# Altium schematic sheet 15-DPLL_2.SchDoc
size C; SheetNumber: 14; SheetTotal: 16
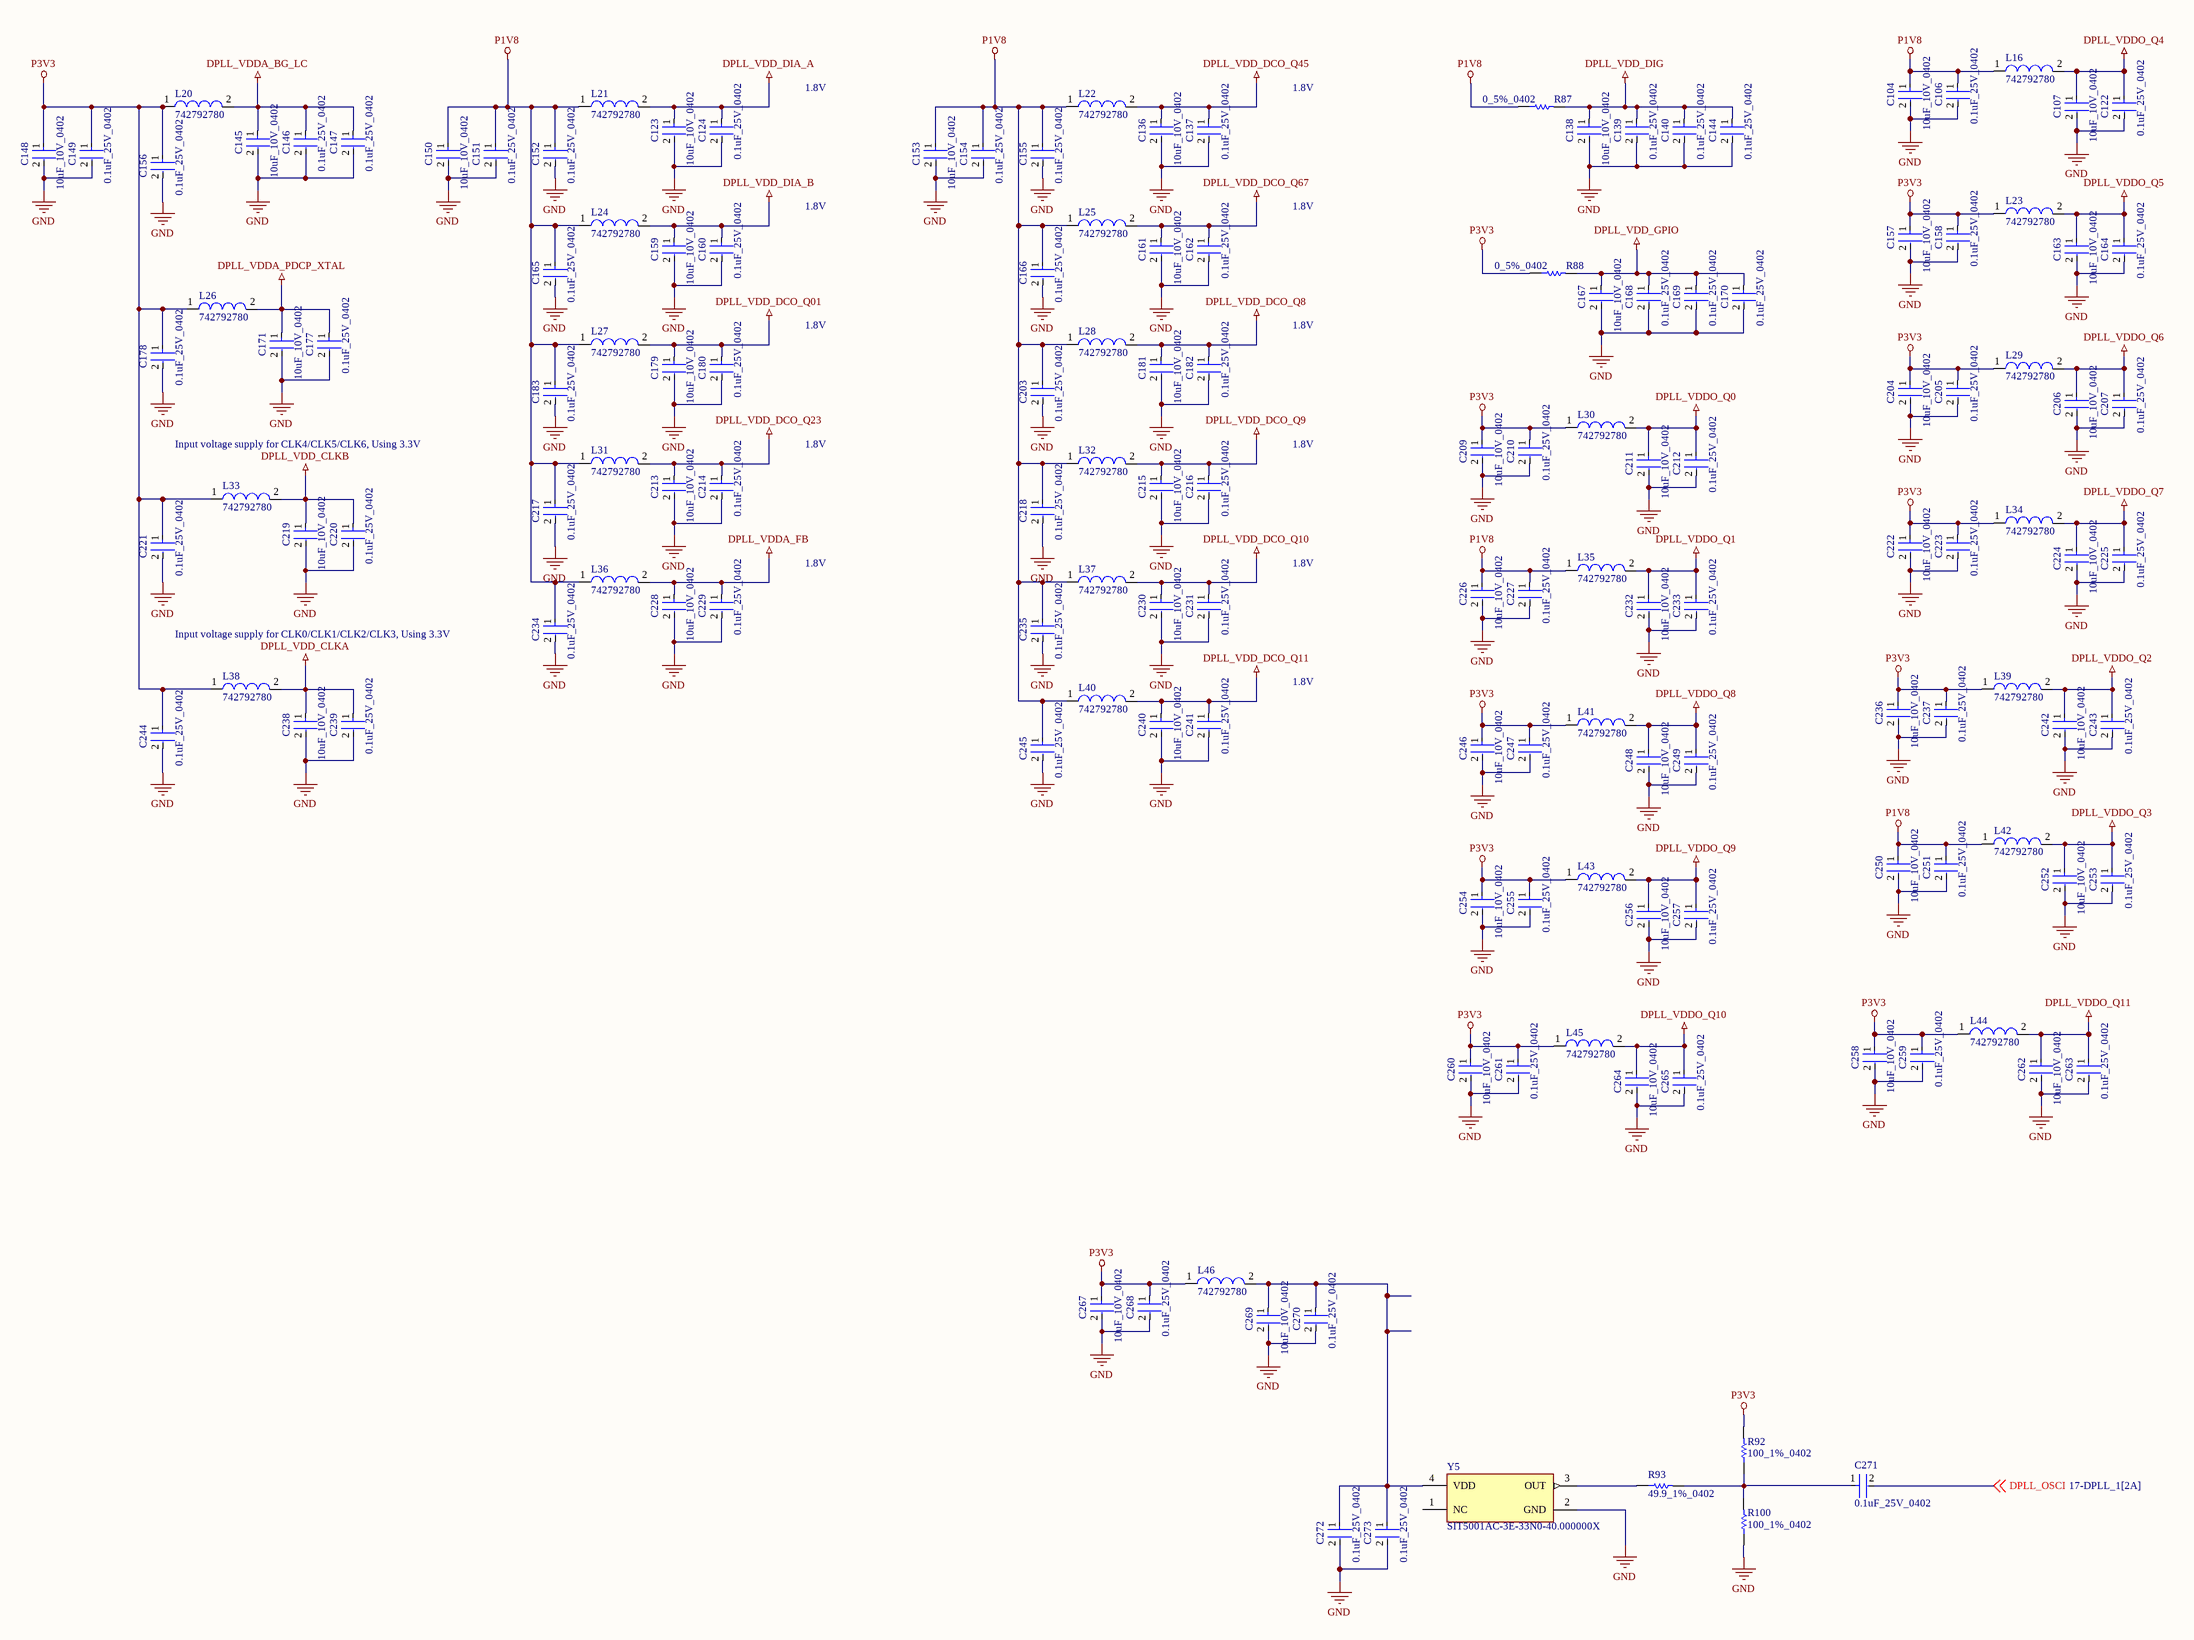
[diagram p0: 15-DPLL_2.SchDoc]

## Parts
C104  10uF_10V_0402  [FP-CL05A106MP5NUNC-MFG]
C106  0.1uF_25V_0402  [FP-0402-L_1_0_1-W_0_5_0_1-IPC_C]
C107  10uF_10V_0402  [FP-CL05A106MP5NUNC-MFG]
C122  0.1uF_25V_0402  [FP-0402-L_1_0_1-W_0_5_0_1-IPC_C]
C123  10uF_10V_0402  [FP-CL05A106MP5NUNC-MFG]
C124  0.1uF_25V_0402  [FP-0402-L_1_0_1-W_0_5_0_1-IPC_C]
C136  10uF_10V_0402  [FP-CL05A106MP5NUNC-MFG]
C137  0.1uF_25V_0402  [FP-0402-L_1_0_1-W_0_5_0_1-IPC_C]
C138  10uF_10V_0402  [FP-CL05A106MP5NUNC-MFG]
C139  0.1uF_25V_0402  [FP-0402-L_1_0_1-W_0_5_0_1-IPC_C]
C140  0.1uF_25V_0402  [FP-0402-L_1_0_1-W_0_5_0_1-IPC_C]
C144  0.1uF_25V_0402  [FP-0402-L_1_0_1-W_0_5_0_1-IPC_C]
C145  10uF_10V_0402  [FP-CL05A106MP5NUNC-MFG]
C146  0.1uF_25V_0402  [FP-0402-L_1_0_1-W_0_5_0_1-IPC_C]
C147  0.1uF_25V_0402  [FP-0402-L_1_0_1-W_0_5_0_1-IPC_C]
C148  10uF_10V_0402  [FP-CL05A106MP5NUNC-MFG]
C149  0.1uF_25V_0402  [FP-0402-L_1_0_1-W_0_5_0_1-IPC_C]
C150  10uF_10V_0402  [FP-CL05A106MP5NUNC-MFG]
C151  0.1uF_25V_0402  [FP-0402-L_1_0_1-W_0_5_0_1-IPC_C]
C152  0.1uF_25V_0402  [FP-0402-L_1_0_1-W_0_5_0_1-IPC_C]
C153  10uF_10V_0402  [FP-CL05A106MP5NUNC-MFG]
C154  0.1uF_25V_0402  [FP-0402-L_1_0_1-W_0_5_0_1-IPC_C]
C155  0.1uF_25V_0402  [FP-0402-L_1_0_1-W_0_5_0_1-IPC_C]
C156  0.1uF_25V_0402  [FP-0402-L_1_0_1-W_0_5_0_1-IPC_C]
C157  10uF_10V_0402  [FP-CL05A106MP5NUNC-MFG]
C158  0.1uF_25V_0402  [FP-0402-L_1_0_1-W_0_5_0_1-IPC_C]
C159  10uF_10V_0402  [FP-CL05A106MP5NUNC-MFG]
C160  0.1uF_25V_0402  [FP-0402-L_1_0_1-W_0_5_0_1-IPC_C]
C161  10uF_10V_0402  [FP-CL05A106MP5NUNC-MFG]
C162  0.1uF_25V_0402  [FP-0402-L_1_0_1-W_0_5_0_1-IPC_C]
C163  10uF_10V_0402  [FP-CL05A106MP5NUNC-MFG]
C164  0.1uF_25V_0402  [FP-0402-L_1_0_1-W_0_5_0_1-IPC_C]
C165  0.1uF_25V_0402  [FP-0402-L_1_0_1-W_0_5_0_1-IPC_C]
C166  0.1uF_25V_0402  [FP-0402-L_1_0_1-W_0_5_0_1-IPC_C]
C167  10uF_10V_0402  [FP-CL05A106MP5NUNC-MFG]
C168  0.1uF_25V_0402  [FP-0402-L_1_0_1-W_0_5_0_1-IPC_C]
C169  0.1uF_25V_0402  [FP-0402-L_1_0_1-W_0_5_0_1-IPC_C]
C170  0.1uF_25V_0402  [FP-0402-L_1_0_1-W_0_5_0_1-IPC_C]
C171  10uF_10V_0402  [FP-CL05A106MP5NUNC-MFG]
C177  0.1uF_25V_0402  [FP-0402-L_1_0_1-W_0_5_0_1-IPC_C]
C178  0.1uF_25V_0402  [FP-0402-L_1_0_1-W_0_5_0_1-IPC_C]
C179  10uF_10V_0402  [FP-CL05A106MP5NUNC-MFG]
C180  0.1uF_25V_0402  [FP-0402-L_1_0_1-W_0_5_0_1-IPC_C]
C181  10uF_10V_0402  [FP-CL05A106MP5NUNC-MFG]
C182  0.1uF_25V_0402  [FP-0402-L_1_0_1-W_0_5_0_1-IPC_C]
C183  0.1uF_25V_0402  [FP-0402-L_1_0_1-W_0_5_0_1-IPC_C]
C203  0.1uF_25V_0402  [FP-0402-L_1_0_1-W_0_5_0_1-IPC_C]
C204  10uF_10V_0402  [FP-CL05A106MP5NUNC-MFG]
C205  0.1uF_25V_0402  [FP-0402-L_1_0_1-W_0_5_0_1-IPC_C]
C206  10uF_10V_0402  [FP-CL05A106MP5NUNC-MFG]
C207  0.1uF_25V_0402  [FP-0402-L_1_0_1-W_0_5_0_1-IPC_C]
C209  10uF_10V_0402  [FP-CL05A106MP5NUNC-MFG]
C210  0.1uF_25V_0402  [FP-0402-L_1_0_1-W_0_5_0_1-IPC_C]
C211  10uF_10V_0402  [FP-CL05A106MP5NUNC-MFG]
C212  0.1uF_25V_0402  [FP-0402-L_1_0_1-W_0_5_0_1-IPC_C]
C213  10uF_10V_0402  [FP-CL05A106MP5NUNC-MFG]
C214  0.1uF_25V_0402  [FP-0402-L_1_0_1-W_0_5_0_1-IPC_C]
C215  10uF_10V_0402  [FP-CL05A106MP5NUNC-MFG]
C216  0.1uF_25V_0402  [FP-0402-L_1_0_1-W_0_5_0_1-IPC_C]
C217  0.1uF_25V_0402  [FP-0402-L_1_0_1-W_0_5_0_1-IPC_C]
C218  0.1uF_25V_0402  [FP-0402-L_1_0_1-W_0_5_0_1-IPC_C]
C219  10uF_10V_0402  [FP-CL05A106MP5NUNC-MFG]
C220  0.1uF_25V_0402  [FP-0402-L_1_0_1-W_0_5_0_1-IPC_C]
C221  0.1uF_25V_0402  [FP-0402-L_1_0_1-W_0_5_0_1-IPC_C]
C222  10uF_10V_0402  [FP-CL05A106MP5NUNC-MFG]
C223  0.1uF_25V_0402  [FP-0402-L_1_0_1-W_0_5_0_1-IPC_C]
C224  10uF_10V_0402  [FP-CL05A106MP5NUNC-MFG]
C225  0.1uF_25V_0402  [FP-0402-L_1_0_1-W_0_5_0_1-IPC_C]
C226  10uF_10V_0402  [FP-CL05A106MP5NUNC-MFG]
C227  0.1uF_25V_0402  [FP-0402-L_1_0_1-W_0_5_0_1-IPC_C]
C228  10uF_10V_0402  [FP-CL05A106MP5NUNC-MFG]
C229  0.1uF_25V_0402  [FP-0402-L_1_0_1-W_0_5_0_1-IPC_C]
C230  10uF_10V_0402  [FP-CL05A106MP5NUNC-MFG]
C231  0.1uF_25V_0402  [FP-0402-L_1_0_1-W_0_5_0_1-IPC_C]
C232  10uF_10V_0402  [FP-CL05A106MP5NUNC-MFG]
C233  0.1uF_25V_0402  [FP-0402-L_1_0_1-W_0_5_0_1-IPC_C]
C234  0.1uF_25V_0402  [FP-0402-L_1_0_1-W_0_5_0_1-IPC_C]
C235  0.1uF_25V_0402  [FP-0402-L_1_0_1-W_0_5_0_1-IPC_C]
C236  10uF_10V_0402  [FP-CL05A106MP5NUNC-MFG]
C237  0.1uF_25V_0402  [FP-0402-L_1_0_1-W_0_5_0_1-IPC_C]
C238  10uF_10V_0402  [FP-CL05A106MP5NUNC-MFG]
C239  0.1uF_25V_0402  [FP-0402-L_1_0_1-W_0_5_0_1-IPC_C]
C240  10uF_10V_0402  [FP-CL05A106MP5NUNC-MFG]
C241  0.1uF_25V_0402  [FP-0402-L_1_0_1-W_0_5_0_1-IPC_C]
C242  10uF_10V_0402  [FP-CL05A106MP5NUNC-MFG]
C243  0.1uF_25V_0402  [FP-0402-L_1_0_1-W_0_5_0_1-IPC_C]
C244  0.1uF_25V_0402  [FP-0402-L_1_0_1-W_0_5_0_1-IPC_C]
C245  0.1uF_25V_0402  [FP-0402-L_1_0_1-W_0_5_0_1-IPC_C]
C246  10uF_10V_0402  [FP-CL05A106MP5NUNC-MFG]
C247  0.1uF_25V_0402  [FP-0402-L_1_0_1-W_0_5_0_1-IPC_C]
C248  10uF_10V_0402  [FP-CL05A106MP5NUNC-MFG]
C249  0.1uF_25V_0402  [FP-0402-L_1_0_1-W_0_5_0_1-IPC_C]
C250  10uF_10V_0402  [FP-CL05A106MP5NUNC-MFG]
C251  0.1uF_25V_0402  [FP-0402-L_1_0_1-W_0_5_0_1-IPC_C]
C252  10uF_10V_0402  [FP-CL05A106MP5NUNC-MFG]
C253  0.1uF_25V_0402  [FP-0402-L_1_0_1-W_0_5_0_1-IPC_C]
C254  10uF_10V_0402  [FP-CL05A106MP5NUNC-MFG]
C255  0.1uF_25V_0402  [FP-0402-L_1_0_1-W_0_5_0_1-IPC_C]
C256  10uF_10V_0402  [FP-CL05A106MP5NUNC-MFG]
C257  0.1uF_25V_0402  [FP-0402-L_1_0_1-W_0_5_0_1-IPC_C]
C258  10uF_10V_0402  [FP-CL05A106MP5NUNC-MFG]
C259  0.1uF_25V_0402  [FP-0402-L_1_0_1-W_0_5_0_1-IPC_C]
C260  10uF_10V_0402  [FP-CL05A106MP5NUNC-MFG]
C261  0.1uF_25V_0402  [FP-0402-L_1_0_1-W_0_5_0_1-IPC_C]
C262  10uF_10V_0402  [FP-CL05A106MP5NUNC-MFG]
C263  0.1uF_25V_0402  [FP-0402-L_1_0_1-W_0_5_0_1-IPC_C]
C264  10uF_10V_0402  [FP-CL05A106MP5NUNC-MFG]
C265  0.1uF_25V_0402  [FP-0402-L_1_0_1-W_0_5_0_1-IPC_C]
C267  10uF_10V_0402  [FP-CL05A106MP5NUNC-MFG]
C268  0.1uF_25V_0402  [FP-0402-L_1_0_1-W_0_5_0_1-IPC_C]
C269  10uF_10V_0402  [FP-CL05A106MP5NUNC-MFG]
C270  0.1uF_25V_0402  [FP-0402-L_1_0_1-W_0_5_0_1-IPC_C]
C271  0.1uF_25V_0402  [FP-0402-L_1_0_1-W_0_5_0_1-IPC_C]
C272  0.1uF_25V_0402  [FP-0402-L_1_0_1-W_0_5_0_1-IPC_C]
C273  0.1uF_25V_0402  [FP-0402-L_1_0_1-W_0_5_0_1-IPC_C]
L16  742792780  [SMD-0402]
L20  742792780  [SMD-0402]
L21  742792780  [SMD-0402]
L22  742792780  [SMD-0402]
L23  742792780  [SMD-0402]
L24  742792780  [SMD-0402]
L25  742792780  [SMD-0402]
L26  742792780  [SMD-0402]
L27  742792780  [SMD-0402]
L28  742792780  [SMD-0402]
L29  742792780  [SMD-0402]
L30  742792780  [SMD-0402]
L31  742792780  [SMD-0402]
L32  742792780  [SMD-0402]
L33  742792780  [SMD-0402]
L34  742792780  [SMD-0402]
L35  742792780  [SMD-0402]
L36  742792780  [SMD-0402]
L37  742792780  [SMD-0402]
L38  742792780  [SMD-0402]
L39  742792780  [SMD-0402]
L40  742792780  [SMD-0402]
L41  742792780  [SMD-0402]
L42  742792780  [SMD-0402]
L43  742792780  [SMD-0402]
L44  742792780  [SMD-0402]
L45  742792780  [SMD-0402]
L46  742792780  [SMD-0402]
R87  0_5%_0402  [RESC1005X40X25LL10T10]
R88  0_5%_0402  [RESC1005X40X25LL10T10]
R92  100_1%_0402  [RESC1005X40X25ML05T10]
R93  49.9_1%_0402  [RESC1005X40X25NL10T10]
R100  100_1%_0402  [RESC1005X40X25ML05T10]
Y5  SIT5001AC-3E-33N0-40.000000X  [FP-SiT5001-3-MFG]

## Nets
DPLL_VDD_CLKA: C238.1 C239.1 L38.2
DPLL_VDD_CLKB: C219.1 C220.1 L33.2
DPLL_VDD_DCO_Q01: C179.1 C180.1 L27.2
DPLL_VDD_DCO_Q8: C181.1 C182.1 L28.2
DPLL_VDD_DCO_Q9: C215.1 C216.1 L32.2
DPLL_VDD_DCO_Q10: C230.1 C231.1 L37.2
DPLL_VDD_DCO_Q11: C240.1 C241.1 L40.2
DPLL_VDD_DCO_Q23: C213.1 C214.1 L31.2
DPLL_VDD_DCO_Q45: C136.1 C137.1 L22.2
DPLL_VDD_DCO_Q67: C161.1 C162.1 L25.2
DPLL_VDD_DIA_A: C123.1 C124.1 L21.2
DPLL_VDD_DIA_B: C159.1 C160.1 L24.2
DPLL_VDD_DIG: C138.1 C139.1 C140.1 C144.1 R87.2
DPLL_VDD_GPIO: C167.1 C168.1 C169.1 C170.1 R88.2
DPLL_VDDA_BG_LC: C145.1 C146.1 C147.1 L20.2
DPLL_VDDA_FB: C228.1 C229.1 L36.2
DPLL_VDDA_PDCP_XTAL: C171.1 C177.1 L26.2
DPLL_VDDO_Q0: C211.1 C212.1 L30.2
DPLL_VDDO_Q1: C232.1 C233.1 L35.2
DPLL_VDDO_Q2: C242.1 C243.1 L39.2
DPLL_VDDO_Q3: C252.1 C253.1 L42.2
DPLL_VDDO_Q4: C107.1 C122.1 L16.2
DPLL_VDDO_Q5: C163.1 C164.1 L23.2
DPLL_VDDO_Q6: C206.1 C207.1 L29.2
DPLL_VDDO_Q7: C224.1 C225.1 L34.2
DPLL_VDDO_Q8: C248.1 C249.1 L41.2
DPLL_VDDO_Q9: C256.1 C257.1 L43.2
DPLL_VDDO_Q10: C264.1 C265.1 L45.2
DPLL_VDDO_Q11: C262.1 C263.1 L44.2
GND: C104.2 C106.2 C107.2 C122.2 C123.2 C124.2 C136.2 C137.2 C138.2 C139.2 C140.2 C144.2 C145.2 C146.2 C147.2 C148.2 C149.2 C150.2 C151.2 C152.2 C153.2 C154.2 C155.2 C156.2 C157.2 C158.2 C159.2 C160.2 C161.2 C162.2 C163.2 C164.2 C165.2 C166.2 C167.2 C168.2 C169.2 C170.2 C171.2 C177.2 C178.2 C179.2 C180.2 C181.2 C182.2 C183.2 C203.2 C204.2 C205.2 C206.2 C207.2 C209.2 C210.2 C211.2 C212.2 C213.2 C214.2 C215.2 C216.2 C217.2 C218.2 C219.2 C220.2 C221.2 C222.2 C223.2 C224.2 C225.2 C226.2 C227.2 C228.2 C229.2 C230.2 C231.2 C232.2 C233.2 C234.2 C235.2 C236.2 C237.2 C238.2 C239.2 C240.2 C241.2 C242.2 C243.2 C244.2 C245.2 C246.2 C247.2 C248.2 C249.2 C250.2 C251.2 C252.2 C253.2 C254.2 C255.2 C256.2 C257.2 C258.2 C259.2 C260.2 C261.2 C262.2 C263.2 C264.2 C265.2 C267.2 C268.2 C269.2 C270.2 C272.2 C273.2 R100.1 Y5.2(GND)
P1V8: C104.1 C106.1 C150.1 C151.1 C152.1 C153.1 C154.1 C155.1 C165.1 C166.1 C183.1 C203.1 C217.1 C218.1 C226.1 C227.1 C234.1 C235.1 C245.1 C250.1 C251.1 L16.1 L21.1 L22.1 L24.1 L25.1 L27.1 L28.1 L31.1 L32.1 L35.1 L36.1 L37.1 L40.1 L42.1 R87.1
P3V3: C148.1 C149.1 C156.1 C157.1 C158.1 C178.1 C204.1 C205.1 C209.1 C210.1 C221.1 C222.1 C223.1 C236.1 C237.1 C244.1 C246.1 C247.1 C254.1 C255.1 C258.1 C259.1 C260.1 C261.1 C267.1 C268.1 L20.1 L23.1 L26.1 L29.1 L30.1 L33.1 L34.1 L38.1 L39.1 L41.1 L43.1 L44.1 L45.1 L46.1 R88.1 R92.2
DPLL_OSCI: C271.2 ; off-sheet DPLL_OSCI
NetC269_1: C269.1 C270.1 C272.1 C273.1 L46.2 Y5.4(VDD)
NetC271_1: C271.1 R92.1 R93.2 R100.2
NetR93_1: R93.1 Y5.3(OUT)

Not connected (* = marked no-connect by the designer): Y5 1(NC)

## Notes on the sheet
- 1.8V
- Input voltage supply for CLK4/CLK5/CLK6, Using 3.3V
- Input voltage supply for CLK0/CLK1/CLK2/CLK3, Using 3.3V

## Library data of the parts
C104 C107 C123 C136 C138 C145 C148 C150 C153 C157 C159 C161 C163 C167 C171 C179 C181 C204 C206 C209 C211 C213 C215 C219 C222 C224 C226 C228 C230 C232 C236 C238 C240 C242 C246 C248 C250 C252 C254 C256 C258 C260 C262 C264 C267 C269 = CMP-13271-000002-1: CAP CER 10UF 10V X5R 0402; Manufacturer Part Number: CL05A106MP5NUNC; Manufacturer: Samsung; Temperature Coefficient: 15%; Tolerance: 20%; Material: Ceramic; Octopart: https://octopart.com/cl05a106mp5nunc-samsung-22457395; Voltage Rating: 10V; RoHS: TRUE; Value: 10uF; Height: 0.7mm; Digikey Description: CAP CER 10UF 10V X5R 0402; Automotive: No; Package: CL05A106MP5NUNC; Device Class L1: Passive Components; Capacitance: 10uF; Temperature Range High: +85°C; ComponentLink2Description: Datasheet; Device Class L2: Capacitors; Temperature Characteristic: X5R; Temperature: -55°C to +85°C; ComponentLink2URL: http://www.samsungsem.com/kr/support/product-search/mlcc/__icsFiles/afieldfile/2019/05/10/19-CL05A106MP5NUNC.pdf; Device Class L3: Ceramic Capacitors; Category: Cap; Temperature Range Low: -55°C; Ipc Land Pattern Name: CAPC10050X50; Lead Free: Yes
C106 C122 C124 C137 C139 C140 C144 C146 C147 C149 C151 C152 C154-C156 C158 C160 C162 C164-C166 C168-C170 C177 C178 C180 C182 C183 C203 C205 C207 C210 C212 C214 C216-C218 C220 C221 C223 C225 C227 C229 C231 C233-C235 C237 C239 C241 C243-C245 C247 C249 C251 C253 C255 C257 C259 C261 C263 C265 C268 C270-C273 = CMP-2008-02519-2: General Purpose Ceramic Capacitor, 0402, 100nF, 10%, X7R, 15%, 25V; Package Quantity: 1; Capacitance: 100nF; Min Operating Temperature: -55°C; Voltage: 25V; Voltage Rating: 25V; Construction: Flat; Max Operating Temperature: 125°C; Radiation Hardening: No; Depth: 0.5mm; Thickness: 0.022inch; Voltage Rating (DC): 25V; Number of Pins: 2; Lead Free: Lead Free; Series: -; REACH SVHC: No SVHC; Length: 1mm; Dielectric: X7R; RoHS Compliant: Yes; Mount: Surface Mount; Packaging: Tape and Reel; Case/Package: 0402; Case Code (Imperial): 0402; Termination: SMD/SMT; Width: 0.02inch; Case Code (Metric): 1005; Tolerance: 10%
L16 L20-L46 = CMP-0220-00137-1: SMD EMI Suppression Ferrite Bead WE-CBF, Z = 220 Ohm; Impedance: 220 Ohm; PackageVersion: 2009; DatasheetVersion: ver 4, Jul-2009; PackageDescription: Chip Inductor, 2-Leads, Body 1.0 x 0.5 mm; ComponentLink1URL: http://www.we-online.com; ComponentLink1Description: Manufacturer Link; ComponentLink2URL: http://www.we-online.de/katalog/media/pdf/742792780.pdf; PackageReference: SMD-0402; ComponentLink2Description: Datasheet
R87 R88 = CMP-2002-04569-1: Manufacturer: KOA Speer; Part Number: RK73Z1ETTP
R92 R100 = CMP-2002-06458-1: Part Number: ERJ-U02F1000X; Manufacturer: Panasonic
R93 = CMP-2002-04448-1: Part Number: RK73H1ETTP49R9F; Manufacturer: KOA Speer
Y5 = CMP-25159-259584-1: MEMS OSC TCXO 40.0000MHZ LVCMOS; Frequency Stability: 5ppm; Max Supply Current: 33mA; Frequency: 40MHz; Case/Package: SMD/SMT; Packaging: Cut Tape; Min Operating Temperature: -20°C; Mount: Surface Mount; Length: 0.197inch; Series: SiT5001; Max Operating Temperature: 70°C; Height: 0.031inch; Width: 0.126inch